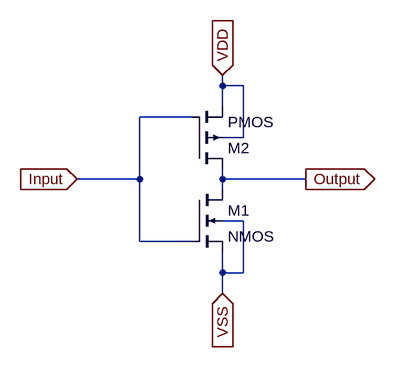
[diagram p0: schematic my_inv.asc]
my_inv.asc, the LTspice schematic file:
Version 4
SHEET 1 880 680
WIRE 96 -48 96 -64
WIRE 128 -48 96 -48
WIRE 96 -16 96 -48
WIRE 48 0 -32 0
WIRE 128 32 128 -48
WIRE 128 32 96 32
WIRE -32 96 -32 0
WIRE -32 96 -128 96
WIRE 96 96 96 80
WIRE 224 96 96 96
WIRE 96 112 96 96
WIRE 128 160 96 160
WIRE -32 192 -32 96
WIRE 48 192 -32 192
WIRE 96 240 96 208
WIRE 128 240 128 160
WIRE 128 240 96 240
WIRE 96 272 96 240
FLAG 96 -64 VDD
IOPIN 96 -64 In
FLAG 96 272 VSS
IOPIN 96 272 In
FLAG 224 96 Output
IOPIN 224 96 Out
FLAG -128 96 Input
IOPIN -128 96 In
SYMBOL nmos4 48 112 R0
SYMATTR InstName M1
SYMATTR Value2 l=0.18u w=1.8u m=1
SYMBOL pmos4 48 80 M180
SYMATTR InstName M2
SYMATTR Value2 l=0.18u w=1.8u m=3

The netlist it stands for:
* my_inv.asc
M1 Output Input VSS VSS NMOS l=0.18u w=1.8u m=1
M2 Output Input VDD VDD PMOS l=0.18u w=1.8u m=3
.model NMOS NMOS
.model PMOS PMOS
.lib standard.mos
.backanno
.end